# EAGLE design Wiper Control (EAGLE 9.6.1)
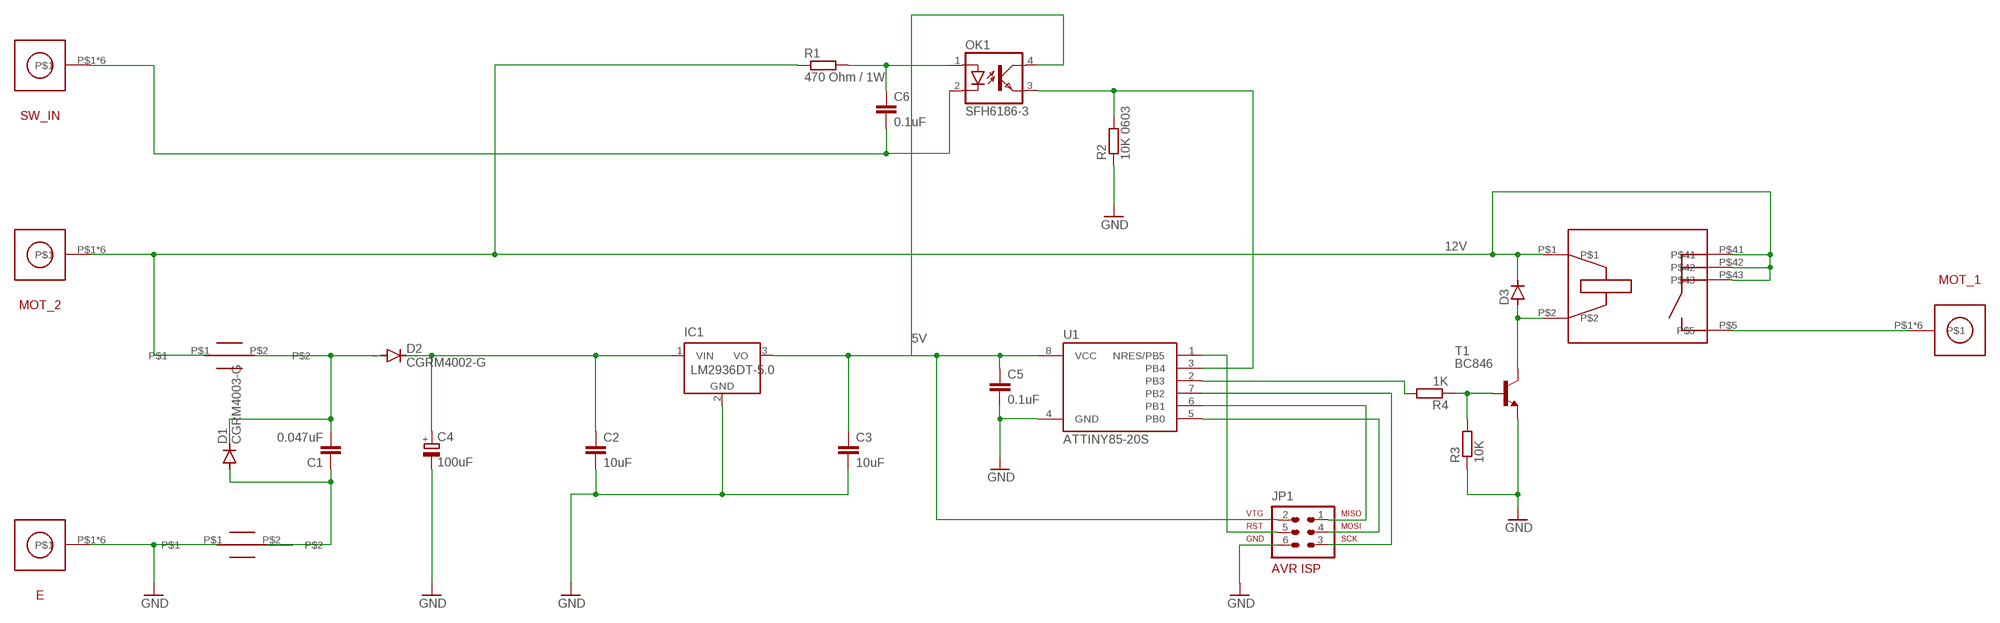
[diagram p0: schematic, sheet 1]

## Parts
C1  0.047uF  C-EUC0603  [C0603]
C2  10uF  C-EUC0805  [C0805]
C3  10uF  C-EUC0805  [C0805]
C4  100uF  CPOL-EUE2.5-7  [E2,5-7]
C5  0.1uF  C-EUC0603  [C0603]
C6  0.1uF  C-EUC0603  [C0603]
D1  CGRM4003-G  [SOD-123_MINI-SMA]
D2  CGRM4002-G  [SOD-123_MINI-SMA]
D3  D-SOD123  [SOD123]
E  M5_SCREW_TERMINAL  [M5_SCREW_TERMINAL]
IC1  LM2936DT-5.0  [TO252]
JP1  AVR-ISP-6  [AVR-ISP-6]
MOT_1  M5_SCREW_TERMINAL  [M5_SCREW_TERMINAL]
MOT_2  M5_SCREW_TERMINAL  [M5_SCREW_TERMINAL]
OK1  SFH6186-3  [SMD4-7]
R1  470 Ohm / 1W  R-EU_R2512  [R2512]
R2  10K 0603  R-EU_R0603  [R0603]
R3  10K  R-EU_R0603  [R0603]
R4  1K  R-EU_R0603  [R0603]
SW_IN  M5_SCREW_TERMINAL  [M5_SCREW_TERMINAL]
T1  BC846  [SOT23]
U1  ATTINY85-20S  [SOIC8_EIAJ_208MIL]
U$1  FBMJ2125  [FBMJ]
U$2  FBMJ2125  [FBMJ]
U$3  RELAY  [RELAY]

## Nets
5V: C3.1 C5.1 IC1.3(VO) JP1.2 OK1.4(COL) U1.8(VCC)
12V: D3.1(C) MOT_2.P$1 MOT_2.P$2 MOT_2.P$3 MOT_2.P$4 MOT_2.P$5 MOT_2.P$6 R1.1 U$1.P$1 U$3.P$1 U$3.P$41 U$3.P$42 U$3.P$43
GND: C2.2 C3.2 C4.- C5.2 E.P$1 E.P$2 E.P$3 E.P$4 E.P$5 E.P$6 IC1.2(GND) JP1.6 R2.1 R3.1 T1.2(E) U1.4(GND) U$2.P$1
N$1: C1.2 D1.C D2.A U$1.P$2
N$2: C1.1 D1.A U$2.P$2
N$3: C2.1 C4.+ D2.C IC1.1(VIN)
N$4: JP1.1 U1.6(PB1)
N$5: JP1.4 U1.5(PB0)
N$6: JP1.3 U1.7(PB2)
N$7: JP1.5 U1.1(NRES/PB5)
N$8: D3.2(A) T1.3(C) U$3.P$2
N$9: R3.2 R4.1 T1.1(B)
N$10: MOT_1.P$1 MOT_1.P$2 MOT_1.P$3 MOT_1.P$4 MOT_1.P$5 MOT_1.P$6 U$3.P$5
N$11: C6.1 OK1.1(A) R1.2
N$13: OK1.3(EMIT) R2.2 U1.3(PB4)
N$14: R4.2 U1.2(PB3)
N$20: C6.2 OK1.2(C) SW_IN.P$1 SW_IN.P$2 SW_IN.P$3 SW_IN.P$4 SW_IN.P$5 SW_IN.P$6

## Library data of the parts
C1-C3 C5 C6 = rcl:C-EU: CAPACITOR, European symbol; SPICEPREFIX: C
C4 = rcl:CPOL-EU: POLARIZED CAPACITOR, European symbol; SPICEPREFIX: C
D1 D2 = diode:CGRM400*-G: Molded plasitc,JEDEC SOD-123/Mini SMA Source: Comchip CGRM4001-G.pdf
D3 = semicon-smd-ipc:D-: DIODE unfilled
E MOT_1 MOT_2 SW_IN = Automotive 12V5V Converter:M5_SCREW_TERMINAL
IC1 = national-semiconductor:LM2936?*: Ultra-Low Quiescent Current LDO Voltage Regulator Source: Data sheet <http://www.national.com/ds/LM/LM2936.pdf>; MF: NATIONAL SEMICONDUCTOR; MPN: LM2936DT-5.0/NOPB; OC_FARNELL: 1286864; OC_NEWARK: 41K4501
JP1 = atmel:AVR-ISP-6: AVR ISP-6 Serial Programming Header
OK1 = optocoupler:SFH618?*: Optocoupler, Phototransistor Output, Low Input Current Source: Data sheet <http://www.vishay.com/docs/83673/sfh618.pdf>; MF: VISHAY/TELEFUNKEN; MPN: SFH6186-3; OC_FARNELL: 1469529; OC_NEWARK: 21H7751
R1-R4 = rcl:R-EU_: RESISTOR, European symbol; SPICEPREFIX: R
T1 = transistor-neu-to92:BC846: NPN TRANSISTOR
U1 = _hhn_attiny25_45_85:ATTINY85*: ATMEL ATtiny 85 Packages: P = PDIP 08 30mil S = SOIC 08 EIAJ 208mil Technologies Note: for complete ordering code (temp. range, finish, tape&reel etc.) see www.atmel.com • Supply Voltage: V = (1.8…5.5)V | [blank] = (2.7…5.5)V • Speed: 10 = 10 MHz | 20 = 20 MHz Author: Dipl.-Ing. FH Rainer Bayer HHN Hochschule Heilbronn (Heilbronn University), rainer.bayer@hs-heilbronn.de Ingenieurbüro ing-rb, mail@ing-rb.de
U$1 U$2 = Automotive 12V5V Converter:FBMJ2125
U$3 = Automotive 12V5V Converter:RELAY

## Board
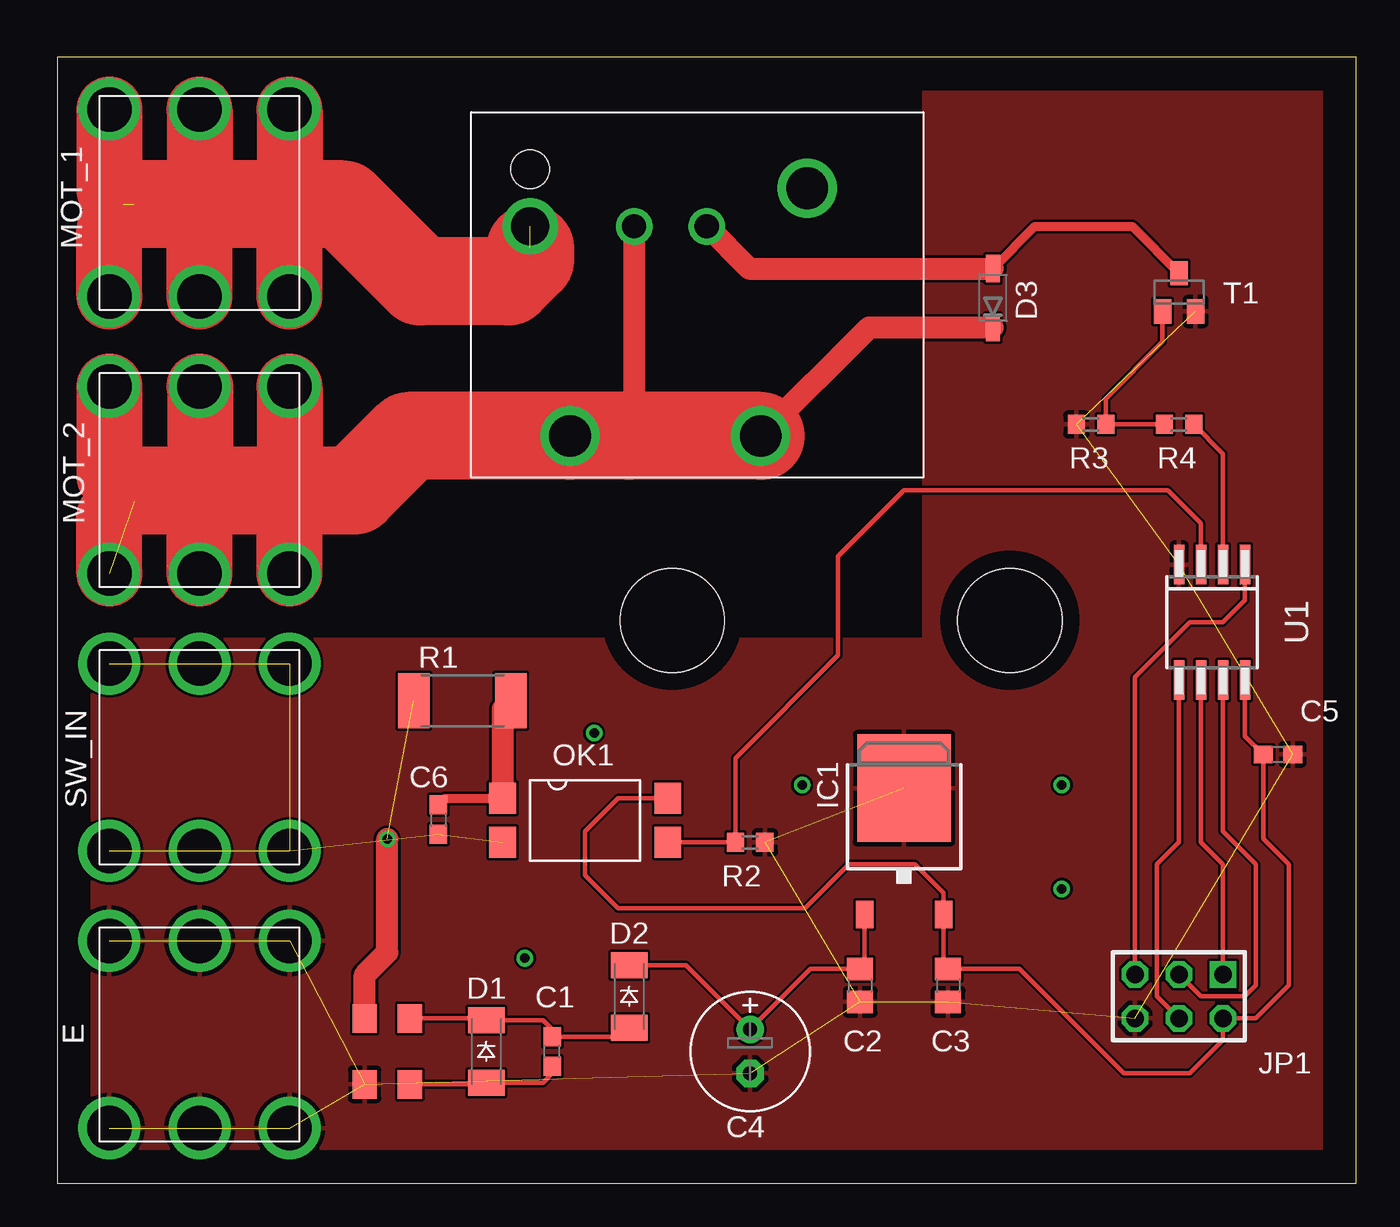
[diagram p1: board, top side]
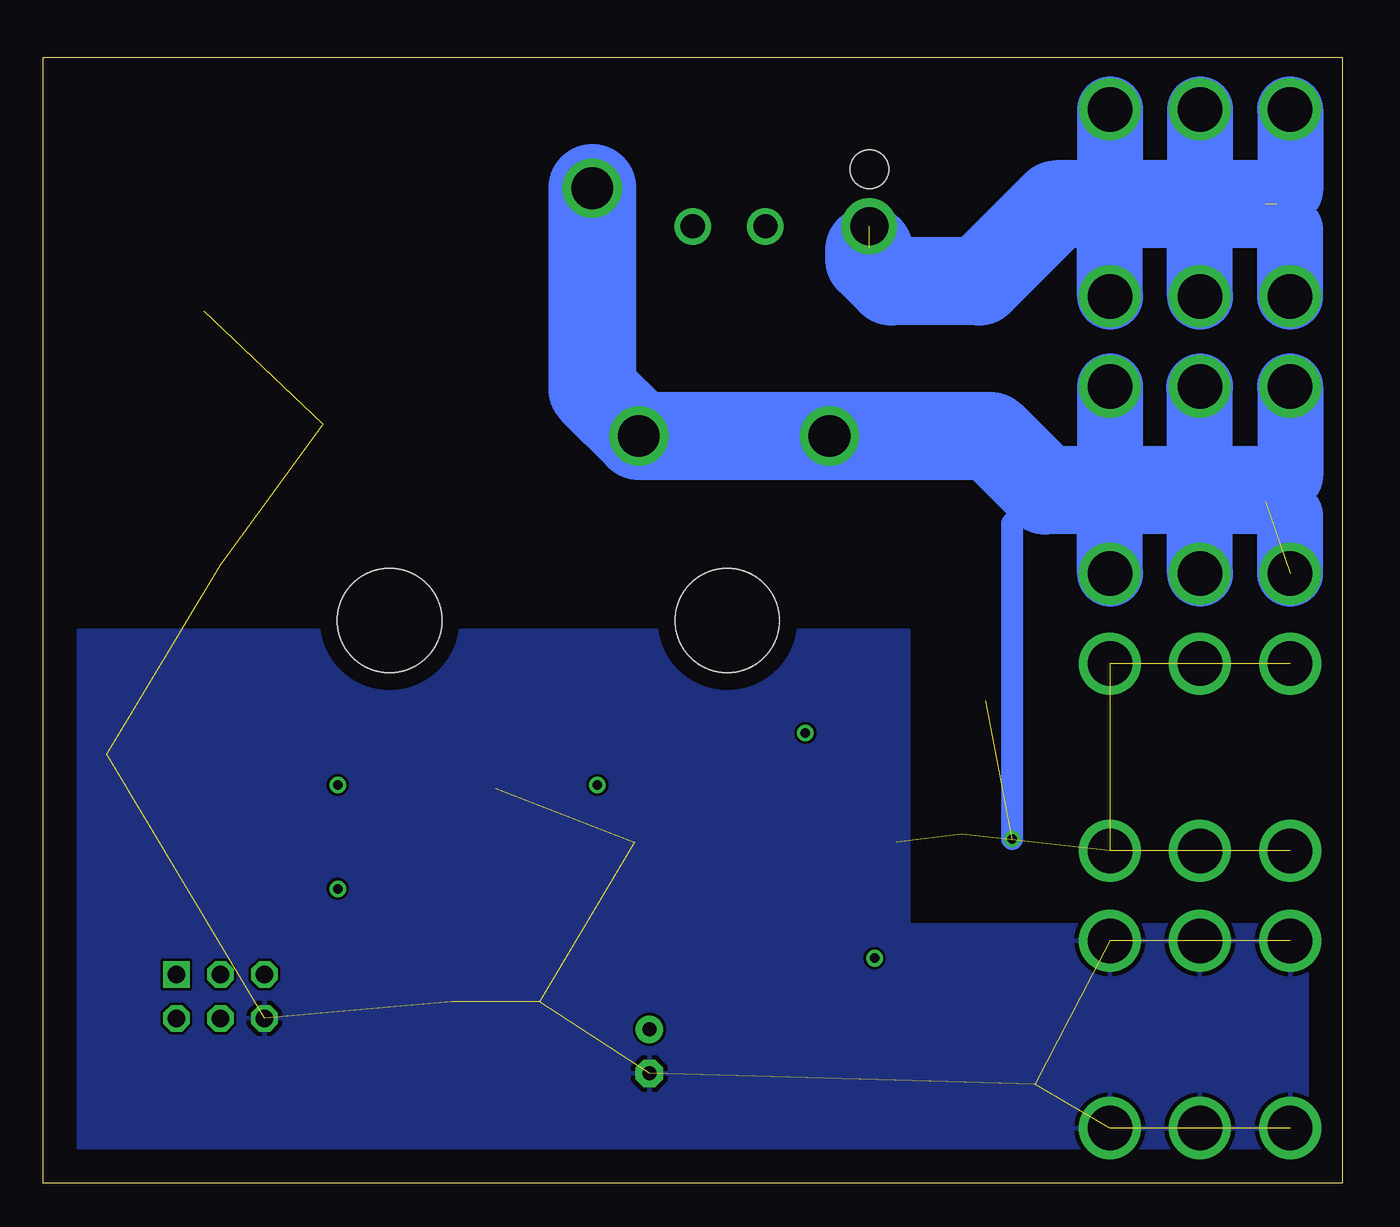
[diagram p2: board, bottom side, seen from below]

Size 75 x 65 mm. Coordinates in mm from the lower left corner, seen from the top.
Outline: 0,0 75,0 75,65 0,65 0,0
Copper layers (1*16): Top 0.035mm / dielectric 1.5mm / Bottom 0.035mm
Design rules "default": minimum track width 6mil, minimum drill 0.35mm, track to track 6mil, track to pad 6mil, pad to pad 6mil, via to via 6mil, smd to smd 6mil, copper to edge 40mil, drill to drill 6mil, minimum pad ring 10mil, minimum via ring 8mil, stop-mask expansion 4mil, vias tented up to drill 0mil, thermal gap 10mil
Holes 6 mm at 55,32.5 35.5,32.5

### Footprints (pad centres in the part's own frame; a part is rotated, then mirrored left to right if it is on the bottom)
C0603 = smd 1.1 x 1: 1 -0.85,0; 2 0.85,0
C0805 = smd 1.3 x 1.5: 1 -0.95,0; 2 0.95,0
E2,5-7 = drill 0.813 pad 1.6: + -1.27,0 | drill 0.813 pad 1.6 octagon: - 1.27,0
SOD-123_MINI-SMA = smd 1.5 x 2.1: A 1.8,0; C -1.8,0
SOD123 = smd 1.6 x 0.8: 1 -1.7,0; 2 1.7,0
M5_SCREW_TERMINAL = drill 2.57: P$1 0,0; P$2 5.21,0; P$3 10.41,0; P$4 0,-10.8; P$5 5.21,-10.8; P$6 10.41,-10.8
TO252 = smd 1 x 1.6: 1 -2.28,-4.8; 3 2.28,-4.8 | smd 5.4 x 6.2: 2 0,2.5
AVR-ISP-6 = drill 1.016 square: 1 -2.54,-1.27 | drill 1.016 octagon: 2 -2.54,1.27; 3 0,-1.27; 4 0,1.27; 5 2.54,-1.27; 6 2.54,1.27
SMD4-7 = smd 1.78 x 1.55: 1 -1.27,-4.77; 2 1.27,-4.77; 3 1.27,4.77; 4 -1.27,4.77
R2512 = smd 1.8 x 3.2: 1 -2.8,0; 2 2.8,0
R0603 = smd 1 x 1.1: 1 -0.85,0; 2 0.85,0
SOT23 = smd 1 x 1.4: 1 -0.95,-1.1; 2 0.95,-1.1; 3 0,1.1
SOIC8_EIAJ_208MIL = smd 0.6 x 2.286: 1 -1.905,-3.33; 2 -0.635,-3.33; 3 0.635,-3.33; 4 1.905,-3.33; 5 1.905,3.33; 6 0.635,3.33; 7 -0.635,3.33; 8 -1.905,3.33
FBMJ = smd 1.4 x 1.65: P$1 -1.3,0; P$2 1.3,0
RELAY = drill 1.4: P$1 6,0; P$2 10.2,0 | drill 2.2: P$5 0,0 | drill 2.4: P$41 2.3,-12.1; P$42 13.3,-12.1; P$43 16,2.2 | hole 2.2: 0,3.3

### Placement (x,y rotation side)
C1  28.57,7.62 90 top
C2  46.35,11.43 270 top
C3  51.44,11.43 270 top
C4  40.01,7.62 270 top
C5  70.48,24.77 0 top
C6  22,21 270 top
D1  24.77,7.62 270 top
D2  33.02,10.79 270 top
D3  54.02,51.1 90 top
E  3,14 0 top
IC1  48.9,20.32 0 top
JP1  64.77,10.79 180 top
MOT_1  3,62 0 top
MOT_2  3,46 0 top
OK1  30.48,20.95 270 top
R1  23.39,27.86 0 top
R2  40.01,19.68 180 top
R3  59.69,43.81 0 top
R4  64.77,43.81 0 top
SW_IN  3,30 0 top
T1  64.77,51.44 0 top
U1  66.67,32.38 180 top
U$1  19.05,9.53 0 top
U$2  19.05,5.71 0 top
U$3  27.3,55.24 0 top

### Tracks (layer width: path | path; a pad name or v marks a point on that pad's centre or on a via)
5V
  Top 0.254: U1.8 68.58,25.82 C5.1 69.64,19.9 71.12,18.41 71.12,11.43 69.22,9.53 JP1.2 67.31,8.26 65.41,6.35 61.59,6.35 55.56,12.38 C3.1 51.17,12.64 IC1.3 51.17,16.77 49.53,18.41 45.72,18.41 43.18,15.88 32.38,15.88 30.48,17.78 30.48,20.32 32.38,22.23 OK1.4
12V  (via drill 0.55)  (2 unrouted)
  Top 1.27: U$3.P$1 33.3,43.43 | D3.1 46.87,49.41 U$3.P$42 | U$1.P$1 17.75,12.04 19.05,13.34 v19.05,19.88
  Top 2.54: 33.3,43.43 33.02,43.15
  Top 3.81: MOT_2.P$1 3,40.81 4.45,39.37 | MOT_2.P$4 3,38.56 4.45,40.01 | MOT_2.P$2 8.26,45.95 8.26,40.01 8.21,39.96 MOT_2.P$5 | MOT_2.P$3 13.41,40.08 | 13.41,40.08 13.34,40.01 | MOT_2.P$6 13.41,40.08
  Top 5.08: U$3.P$42 33.02,43.15 U$3.P$41 20.29,43.15 17.14,40.01 13.34,40.01 8.26,40.01 4.45,40.01
  Bottom 1.27: v19.05,19.88 19.05,38.1 17.14,40.01
  Bottom 3.81: MOT_2.P$1 3,40.81 3.17,40.64 | MOT_2.P$4 3,38.56 4.45,40.01 | MOT_2.P$5 8.21,39.96 8.26,40.01 8.26,45.95 MOT_2.P$2 | MOT_2.P$3 13.41,40.08 | 13.41,40.08 13.34,40.01 | MOT_2.P$6 13.41,40.08
  Bottom 5.08: U$3.P$43 43.3,45.84 U$3.P$42 U$3.P$41 20.29,43.15 17.14,40.01 13.34,40.01 8.26,40.01 4.45,40.01
GND  (16 unrouted)
  pour Top: 2,2 2,31.45 50,31.45 50,63 73,63 73,2
  pour Bottom: 2,2 73,2 73,32 25,32 25,15 2,15
N$1
  Top 0.254: U$1.P$2 24.66,9.53 D1.C 28.05,9.42 28.57,8.89 C1.2 32.49,8.47 D2.A
N$2
  Top 0.254: C1.1 28.57,6.35 28.05,5.82 D1.A 24.66,5.71 U$2.P$2
N$3
  Top 0.254: IC1.1 46.62,12.64 C2.1 43.49,12.38 C4.+ 36.3,12.6 D2.C
N$4
  Top 0.254: JP1.1 67.31,18.41 66.04,19.68 U1.6
N$5
  Top 0.254: JP1.4 63.5,10.79 63.5,18.41 64.77,19.68 U1.5
N$6
  Top 0.254: JP1.3 66.04,10.79 68.58,10.79 69.22,11.43 69.22,18.41 67.31,20.32 U1.7
N$7
  Top 0.254: JP1.5 62.23,29.21 65.41,32.38 67.31,32.38 68.58,33.66 U1.1
N$8
  Top 0.508: D3.2 56.46,55.24 62.06,55.24 T1.3
  Top 1.27: U$3.P$2 39.95,52.8 D3.2
N$9
  Top 0.254: T1.1 63.82,48.58 60.54,45.3 R3.2 R4.1
N$10  (2 unrouted)
  Top 3.81: MOT_1.P$1 3,57.33 4.45,55.88 | MOT_1.P$2 8.21,56.56 8.26,56.52 8.21,56.47 MOT_1.P$5 | MOT_1.P$3 13.41,56.59 13.34,56.52 13.41,56.44 MOT_1.P$6 | MOT_1.P$4 3,55.07 3.81,55.88
  Top 5.08: 27.3,53.98 27.3,53.34 26.04,52.07 20.95,52.07 16.51,56.52 13.34,56.52 8.26,56.52 4.45,56.52
  Bottom 3.81: MOT_1.P$1 3,57.33 3.81,56.52 | MOT_1.P$4 3,55.07 4.45,56.52 | MOT_1.P$2 8.21,57.1 7.62,56.52 8.21,55.92 MOT_1.P$5 | MOT_1.P$6 13.41,56.44 13.34,56.52 13.41,56.59 MOT_1.P$3
  Bottom 5.08: 4.45,56.52 7.62,56.52 13.34,56.52 16.51,56.52 20.95,52.07 26.04,52.07 27.3,53.34 27.3,53.89
N$11
  Top 0.508: C6.1 22.38,22.23 OK1.1
  Top 1.27: R1.2 25.71,27.39 OK1.1
N$13
  Top 0.254: OK1.3 R2.2 39.16,24.55 45.09,30.48 45.09,36.2 48.9,40.01 64.14,40.01 66.04,38.1 U1.3
N$14
  Top 0.254: R4.2 67.31,42.12 U1.2
N$15  (via drill 0.55)
  other vias: 58,23
N$16  (via drill 0.55)
  other vias: 58,17
N$17  (via drill 0.55)
  other vias: 43,23
N$18  (via drill 0.55)
  other vias: 31,26
N$19  (via drill 0.55)
  other vias: 27,13
N$20  (7 unrouted)